# Altium schematic sheet 07_Buzzer.SchDoc: ECE315 Analog
size A; Date: 4/25/2017; ApprovedBy: JSK; CheckedBy: JSK; Author: JSK; CompanyName: University of Wisconsin; DrawnBy: JSK; Engineer: JSK; Organization: ECE 315; Address1: College of Engineering; Address2: 1415 Engineering Drive; Address3: Madison, WI 53706; Address4: ECE 315 Fall 2017; Revision: A; SheetNumber: 2; SheetTotal: 2; AssemblyNumber: ECE315-F19; ApprovedDate: 04/02/2019
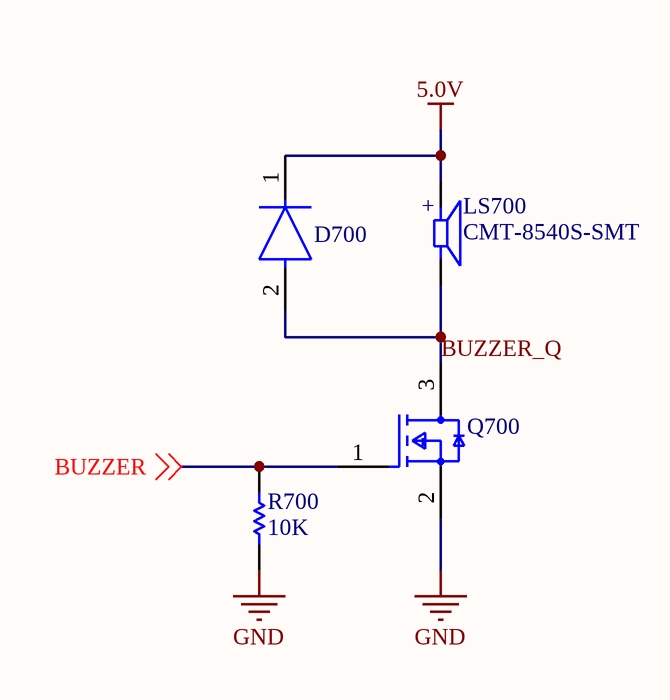
[diagram p0: 07_Buzzer.SchDoc]

## Parts
D700  CGRM4004-G  [Diodes_SOD123_IPC_A]  (value not drawn)
LS700  CMT-8540S-SMT  [CUI_CMT-8540S-SMT]
Q700  DMN6140L-13  [Diodes_Inc_SOT23_IPC_A]  (value not drawn)
R700  Resistance: 10K  [RES_0805]  (hidden comment: RES_0805_K_010.00)

## Nets
5.0V: D700.1(C) LS700.P
GND: Q700.2(S) R700.1
BUZZER: Q700.1(G) R700.2 ; off-sheet BUZZER
BUZZER_Q: D700.2(A) LS700.N Q700.3(D)

## Notes on the sheet
- (in symbol CMT-8540S-SMT) +

## Library data of the parts
D700 = CGRM4004-G: DIODE GEN PURP 400V 1A MINISMA; Manufacturer 1: Comchip; Max Surge Current: 30A; Max Reverse Current: 5uA; Supplier 1: Digi-Key; Supplier Part Number 1: 641-1329-1-ND; Manufacturer Part Number 1: CGRM4004-G; RoHS: Yes; Category: Rectifier Diodes; Stock 1: 345536; Pricing 1: 1=0.41000, 10=0.30400, 100=0.17190, 500=0.11384, 1000=0.08728 (USD); Mount: Surface Mount; Package Quantity: 1; Packaging: Tape and Reel; Average Rectified Current: 1A; Reverse Voltage: 400V; Max Reverse Voltage (DC): 400V; RoHS Compliant: Yes; ComponentLink1URL: https://datasheet.ciiva.com/912/cgrm4001-gthru-cgrm4007-grevd-912412.pdf?src-supplier=Digi-Key; ComponentLink1Description: https://datasheet.ciiva.com/912/cgrm4001-gthru-cgrm4007-grevd-912412.pdf?src-supplier=Digi-Key; ComponentLink2URL: https://datasheet.ciiva.com/912/cgrm4001-gthru-cgrm4007-grevd-912413.pdf?src-supplier=Digi-Key; ComponentLink2Description: https://datasheet.ciiva.com/912/cgrm4001-gthru-cgrm4007-grevd-912413.pdf?src-supplier=Digi-Key; ComponentLink3URL: https://datasheet.ciiva.com/912/cgrm4001-gthru-cgrm4007-grevd-912414.pdf?src-supplier=Digi-Key; ComponentLink3Description: https://datasheet.ciiva.com/912/cgrm4001-gthru-cgrm4007-grevd-912414.pdf?src-supplier=Digi-Key
LS700 = CMT-8540S-SMT: AUDIO MAGNETIC XDCR 1-6V SMD; Manufacturer 1: CUI; MF: CUI Devices; MP: CMT-8540S-SMT-TR; Voltage Rating: 5V; Frequency: 4kHz; Operating Supply Current: 150mA; CUI_purchase_URL: https://www.cuidevices.com/product/audio/buzzers/audio-transducers/cmt-8540s-smt-tr?utm_source=snapeda.com&utm_medium=referral&utm_campaign=snapedaBOM; SnapEDA_Link: https://www.snapeda.com/parts/CMT-8540S-SMT-TR/CUI%20Devices/view-part/587791/?ref=snap; Availability: Unavailable; Package: CUI Inc.; Value: *; Price: None; Supplier 1: Digi-Key; Supplier Part Number 1: 102-3746-1-ND; Manufacturer Part Number 1: CMT-8540S-SMT-TR; RoHS: Yes; Category: Audio Products; Stock 1: 66147; Pricing 1: 1=3.23000, 10=2.67000, 25=2.46400, 50=2.31400, 100=2.16990, 500=1.91520 (USD); Min Operating Temperature: -20°C; Max Operating Temperature: 70°C; Sensing Method: Magnetic; Lead Free: Lead Free; ComponentLink1URL: https://www.cui.com/product/resource/digikeypdf/cmt-8540s-smt.pdf?src-supplier=Digi-Key; ComponentLink1Description: https://www.cui.com/product/resource/digikeypdf/cmt-8540s-smt.pdf?src-supplier=Digi-Key
Q700 = DMN6140L-13: MOSFET N-CH 60V 300MA SOT23-3; Manufacturer 1: Diodes; Manufacturer Part Number 1: 2N7002K-7; Nominal Vgs: 1.6V; Rds On Max: 2R; Input Capacitance: 50pF; Rise Time: 3.4ns; Number of Elements: 1; Max Power Dissipation: 540mW; Continuous Drain Current (ID): 380mA; Drain to Source Resistance: 3R; Gate to Source Voltage (Vgs): 20V; Fall Time: 9.9ns; Turn-Off Delay Time: 15.7ns; Turn-On Delay Time: 3.9ns; Element Configuration: Single; Polarity: N-CHANNEL; ComponentLink1URL: https://datasheet.ciiva.com/29746/dmn6140l-29746783.pdf?src-supplier=Digi-Key; ComponentLink1Description: https://datasheet.ciiva.com/29746/dmn6140l-29746783.pdf?src-supplier=Digi-Key; Supplier 1: Digi-Key; Supplier Part Number 1: 2N7002K-7DICT-ND; RoHS: Yes; Category: MOSFETs; Stock 1: 643550; Pricing 1: 1=0.22000, 10=0.18300, 25=0.15360, 100=0.09720, 500=0.06394, 1000=0.04348 (USD); Mount: Surface Mount; Case/Package: SOT-23; Number of Pins: 3; Weight: 0.000282oz; Min Operating Temperature: -55°C; Max Operating Temperature: 150°C; Package Quantity: 3000; Packaging: Tape and Reel; Drain to Source Voltage (Vdss): 60V; Number of Channels: 1; Drain to Source Breakdown Voltage: 60V; Threshold Voltage: 1.6V; Power Dissipation: 540mW; On-State Resistance: 2R; Series: -; Drain-source On Resistance-Max: 2R; Length: 2.9mm; Width: 1.3mm; Height: 1mm; Radiation Hardening: No; REACH SVHC: No SVHC; Lead Free: Lead Free; RoHS Compliant: Yes; ComponentLink2URL: https://datasheet.ciiva.com/4444/ds30896-81375-4444887.pdf?src-supplier=Mouser; ComponentLink2Description: https://datasheet.ciiva.com/4444/ds30896-81375-4444887.pdf?src-supplier=Mouser; ComponentLink3URL: https://datasheet.ciiva.com/1254/ds30896-1254496.pdf?src-supplier=Newark; ComponentLink3Description: https://datasheet.ciiva.com/1254/ds30896-1254496.pdf?src-supplier=Newark; ComponentLink4URL: https://datasheet.ciiva.com/25624/0900766b81151e8c-25624936.pdf?src-supplier=RSComponents; ComponentLink4Description: https://datasheet.ciiva.com/25624/0900766b81151e8c-25624936.pdf?src-supplier=RSComponents; ComponentLink5URL: https://datasheet.ciiva.com/15137/getdatasheetpartid-75159-15137378.pdf?src-supplier=Verical; ComponentLink5Description: https://datasheet.ciiva.com/15137/getdatasheetpartid-75159-15137378.pdf?src-supplier=Verical; ComponentLink6URL: https://datasheet.ciiva.com/48532/ds30896-48532645.pdf?src-supplier=Avnet; ComponentLink6Description: https://datasheet.ciiva.com/48532/ds30896-48532645.pdf?src-supplier=Avnet; ComponentLink7URL: https://datasheet.ciiva.com/1188/ds30896-1188422.pdf?src-supplier=Element14; ComponentLink7Description: https://datasheet.ciiva.com/1188/ds30896-1188422.pdf?src-supplier=Element14; ComponentLink8URL: https://datasheet.ciiva.com/16200/ds30896-16200842.pdf?src-supplier=Future+Electronics; ComponentLink8Description: https://datasheet.ciiva.com/16200/ds30896-16200842.pdf?src-supplier=Future+Electronics; ComponentLink9URL: https://datasheet.ciiva.com/17323/ds30896-17323945.pdf?src-supplier=Avnet+Europe; ComponentLink9Description: https://datasheet.ciiva.com/17323/ds30896-17323945.pdf?src-supplier=Avnet+Europe
R700 = RES_0805_K_010.00: RES 10K 1/10W 1% 0805 SMD; Manufacturer 1: Yageo; Manufacturer Part Number 1: RC0805FR-0710KL; Temperature Coefficient: 100ppm/°C; Power Rating: 125mW; Voltage Rating: 150V; Supplier 1: Digi-Key; Supplier Part Number 1: 311-10.0KCRDKR-ND; Stock 1: 23045964; Pricing 1: 1=0.10000, 10=0.04000, 100=0.01630, 1000=0.00731, 2500=0.00635 (USD); RoHS: Yes; Case/Package: 0805; Case Code (Imperial): 0805; Case Code (Metric): 2012; Min Operating Temperature: -55°C; Max Operating Temperature: 155°C; Composition: Thick Film; Tolerance: 1%; Packaging: Tape and Reel; Features: Moisture Resistant; Termination: SMD/SMT; Number of Terminations: 2; Military Standard: Not; Max Power Dissipation: 125mW; Package Quantity: 1; Length: 2mm; Height: 0.024inch; Width: 0.049inch; Depth: 1.25mm; Lead Free: Lead Free; REACH SVHC: Unknown; ComponentLink1URL: https://datasheet.ciiva.com/11808/0900766b8106beab-11808151.pdf?src-supplier=RSComponents; ComponentLink1Description: https://datasheet.ciiva.com/11808/0900766b8106beab-11808151.pdf?src-supplier=RSComponents; ComponentLink2URL: https://datasheet.ciiva.com/12669/rc0805-12669688.pdf?src-supplier=Mouser; ComponentLink2Description: https://datasheet.ciiva.com/12669/rc0805-12669688.pdf?src-supplier=Mouser; ComponentLink3URL: https://datasheet.ciiva.com/46447/444164-46447563.pdf?src-supplier=Element14; ComponentLink3Description: https://datasheet.ciiva.com/46447/444164-46447563.pdf?src-supplier=Element14; ComponentLink4URL: https://datasheet.ciiva.com/2456/pyu-r-int-thick-7-2456972.pdf?src-supplier=Digi-Key; ComponentLink4Description: https://datasheet.ciiva.com/2456/pyu-r-int-thick-7-2456972.pdf?src-supplier=Digi-Key; ComponentLink5URL: https://datasheet.ciiva.com/2456/pyu-r-int-thick-7-2456973.pdf?src-supplier=Digi-Key; ComponentLink5Description: https://datasheet.ciiva.com/2456/pyu-r-int-thick-7-2456973.pdf?src-supplier=Digi-Key; ComponentLink6URL: https://datasheet.ciiva.com/2456/pyu-r-int-thick-7-2456974.pdf?src-supplier=Digi-Key; ComponentLink6Description: https://datasheet.ciiva.com/2456/pyu-r-int-thick-7-2456974.pdf?src-supplier=Digi-Key; ComponentLink7URL: https://datasheet.ciiva.com/16747/rc0805-16747087.pdf?src-supplier=Future+Electronics; ComponentLink7Description: https://datasheet.ciiva.com/16747/rc0805-16747087.pdf?src-supplier=Future+Electronics